# Altium schematic sheet TPs.SchDoc
size A4; DocumentNumber: 2; SheetNumber: 4; SheetTotal: 5
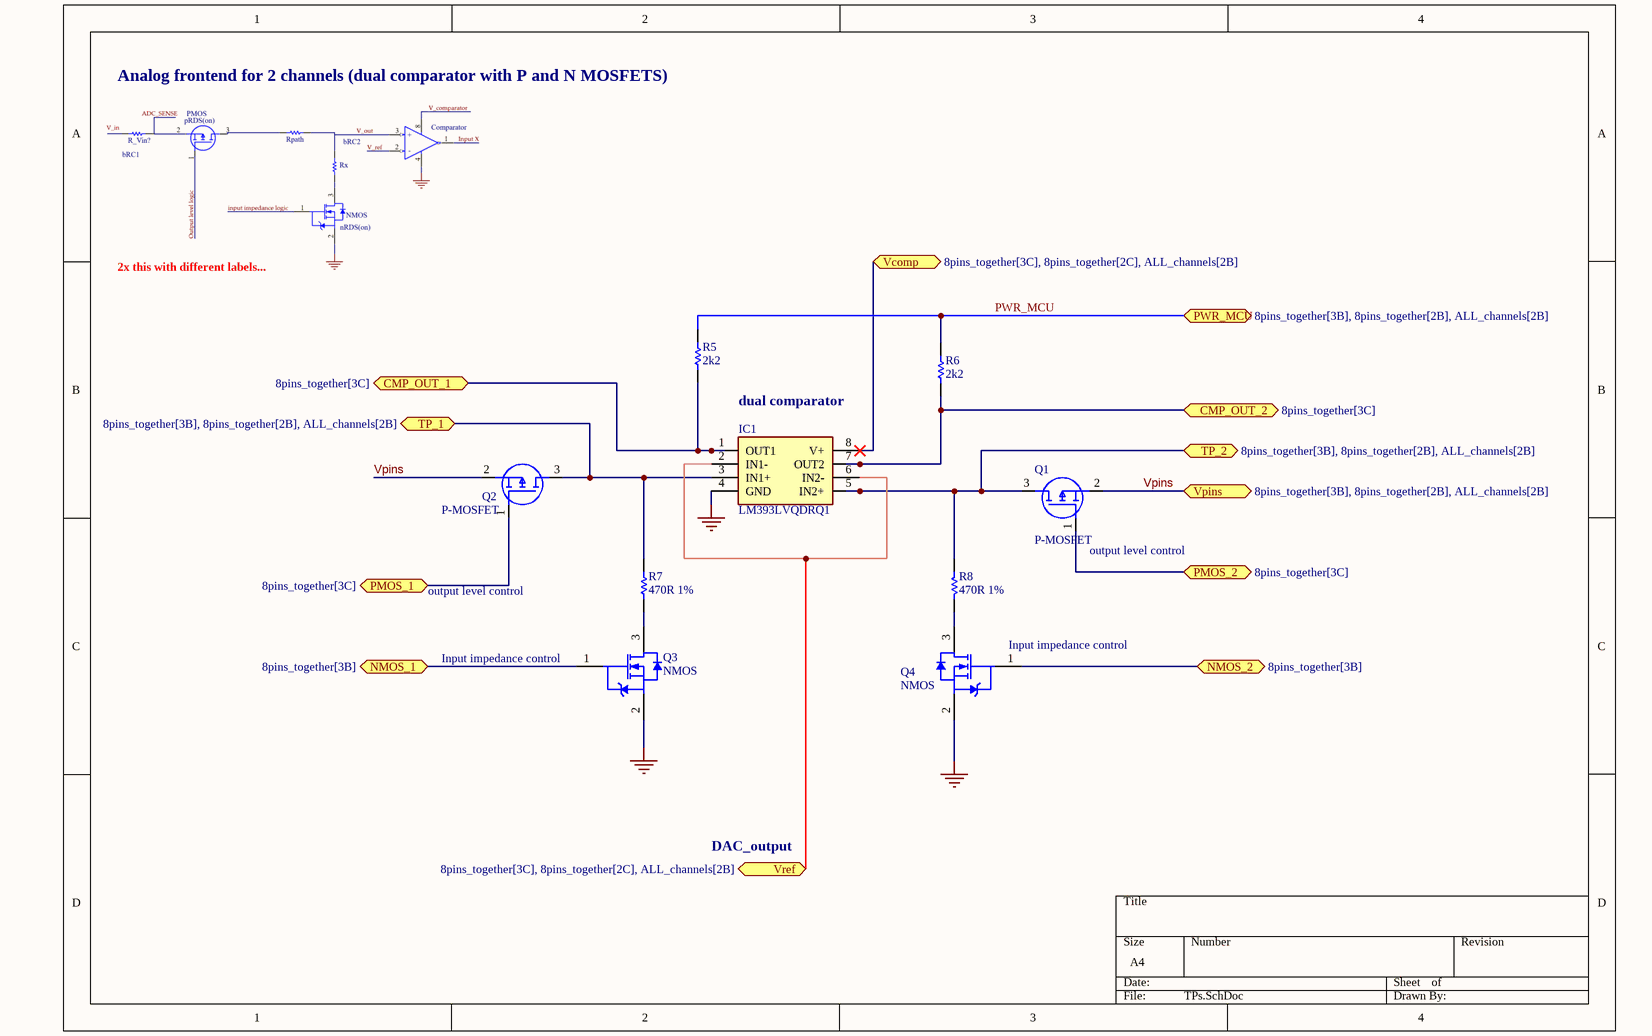
[diagram p0: TPs.SchDoc]

## Parts
IC1  LM393LVQDRQ1  [SOIC127P600X175-8N]
Q1  P-MOSFET  [SOTFL95P240X88-3N]
Q2  P-MOSFET  [SOTFL95P240X88-3N]
Q3  NMOS  [SOT95P240X110-3N]
Q4  NMOS  [SOT95P240X110-3N]
R5  2k2  [RESC1005X40X25NL05T05]
R6  2k2  [RESC1005X40X25NL05T05]
R7  470R 1%  [RESC1005X40X25NL05T05]
R8  470R 1%  [RESC1005X40X25NL05T05]

## Ports
CMP_OUT_1 (bidir, see 8pins_together[3C]), CMP_OUT_2 (bidir, see 8pins_together[3C]), NMOS_1 (bidir, see 8pins_together[3B]), NMOS_2 (bidir, see 8pins_together[3B]), PMOS_1 (bidir, see 8pins_together[3C]), PMOS_2 (bidir, see 8pins_together[3C]), PWR_MCU (bidir, see 8pins_together[3B], 8pins_together[2B], ALL_channels[2B]), TP_1 (bidir, see 8pins_together[3B], 8pins_together[2B], ALL_channels[2B]), TP_2 (bidir, see 8pins_together[3B], 8pins_together[2B], ALL_channels[2B]), Vcomp (bidir, see 8pins_together[3C], 8pins_together[2C], ALL_channels[2B]), Vpins (bidir, see 8pins_together[3B], 8pins_together[2B], ALL_channels[2B]), Vref (bidir, see 8pins_together[3C], 8pins_together[2C], ALL_channels[2B])

## Nets
GND: IC1.4(GND) Q3.2(S) Q4.2(S)
CMP_OUT_1: IC1.1(OUT1) R5.2 ; port CMP_OUT_1
CMP_OUT_2: IC1.7(OUT2) R6.2 ; port CMP_OUT_2
NMOS_1: Q3.1(G) ; port NMOS_1
NMOS_2: Q4.1(G) ; port NMOS_2
PMOS_1: Q2.1(G) ; port PMOS_1
PMOS_2: Q1.1(G) ; port PMOS_2
PWR_MCU: R5.1 R6.1 ; port PWR_MCU
TP_1: IC1.3(IN1+) Q2.3(D) R7.1 ; port TP_1
TP_2: IC1.5(IN2+) Q1.3(D) R8.1 ; port TP_2
Vcomp: IC1.8(V+) ; port Vcomp
Vpins: Q1.2(S) Q2.2(S) ; port Vpins
Vref: IC1.2(IN1-) IC1.6(IN2-) ; port Vref
NetQ3_3: Q3.3(D) R7.2
NetQ4_3: Q4.3(D) R8.2

## Notes on the sheet
- Analog frontend for 2 channels (dual comparator with P and N MOSFETS)
- 2x this with different labels...
- dual comparator
- (near Q1) output level control
- output level control
- (near Q4) Input impedance control
- (near Q3) Input impedance control
- DAC_output

## Library data of the parts
IC1 = LM393LVQDRQ1: Integrated Circuit; Manufacturer_Name: Texas Instruments; Datasheet Link: https://www.ti.com/lit/gpn/lm393lv-q1; Height: 1.75mm; Manufacturer_Part_Number: LM393LVQDRQ1; Mouser Part Number: 595-LM393LVQDRQ1; Mouser Price/Stock: https://www.mouser.co.uk/ProductDetail/Texas-Instruments/LM393LVQDRQ1?qs=IS%252B4QmGtzzqk8QFsvXuXMw%3D%3D; Arrow Part Number: LM393LVQDRQ1; Arrow Price/Stock: https://www.arrow.com/en/products/lm393lvqdrq1/texas-instruments?region=nac
Q1 Q2 = P-MOSFET: MOSFET (P-Channel) - low RDS on; Manufacturer_Name: Toshiba; Manufacturer_Part_Number: SSM3J358R,LF; Datasheet Link: https://toshiba.semicon-storage.com/ap-en/product/mosfet/detail.SSM3J358R.html; Height: 0.88mm; Mouser Part Number: 757-SSM3J358RLF; Mouser Price/Stock: https://www.mouser.co.uk/ProductDetail/Toshiba/SSM3J358RLF?qs=HXFqYaX1Q2xwvCtt1GGmkw%3D%3D; Arrow Part Number: SSM3J358R,LF; Arrow Price/Stock: https://www.arrow.com/en/products/ssm3j358rlf/toshiba?region=nac
Q3 Q4 = N-MOSFET: N-Channel MOSFET Transistor PJA3432_R1_00001; Manufacturer: Fairchild; Typical Turn-On Delay Time: 3ns; Channel Mode: Enhancement; RDS-on: 450@4.5VmOhm; Maximum Continuous Drain Current: 0.68A; Maximum Drain Source Voltage: 25V; Rad Hard: No; Typical Fall Time: 13ns; Channel Type: N; Typical Turn-Off Delay Time: 17ns; Maximum Gate Source Voltage: 8V; Typical Rise Time: 8.5ns; Mounting: SurfaceMount; Packaging: Tape&Reel; Package: 3SOT-23; Category: MOSFET; Operating Temperature: -55to150degC; Datasheet Version: Rev. D2, 07/2014
R5-R8 = Resistor 0402 100mW: Part Number: ERJ2RKF6800X; Manufacturer: Panasonic